# Altium schematic sheet Micro.SchDoc
size A
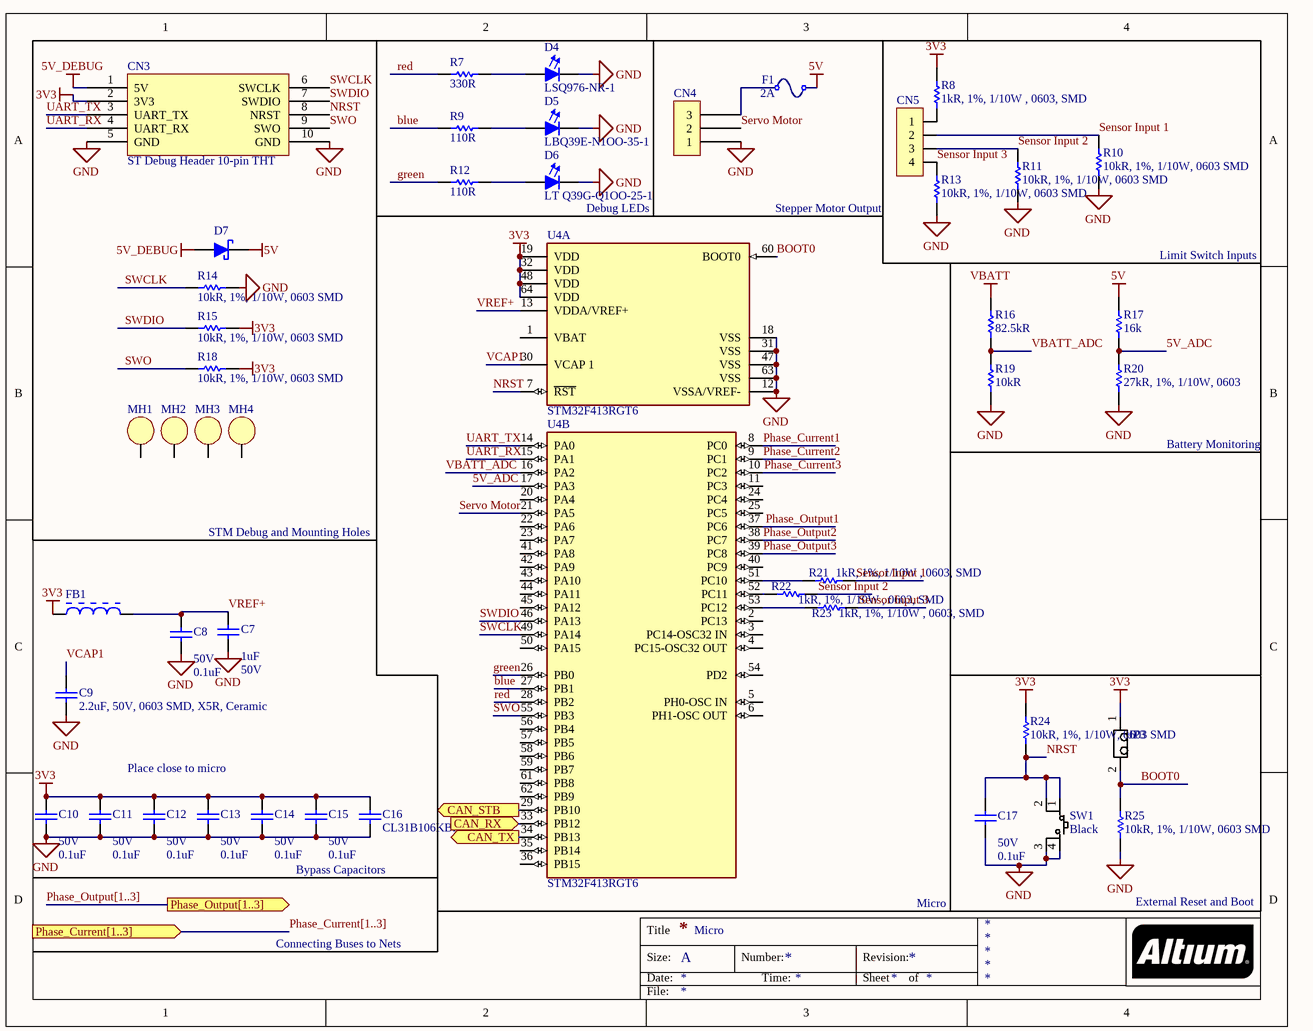
[diagram p0: Micro.SchDoc]

## Parts
C7  Capacitance: 1uF  Voltage: 50V  [0803 CAP]  (hidden comment: CL21B105KBFNNNG)
C8  Voltage: 50V  Capacitance: 0.1uF  [FP-CL10-0_1-IPC_A]  (hidden comment: CL10B104JB8NNNC)
C9  2.2uF, 50V, 0603 SMD, X5R, Ceramic  [CAPC1608N(0603")]
C10  Voltage: 50V  Capacitance: 0.1uF  [FP-CL10-0_1-IPC_A]  (hidden comment: CL10B104JB8NNNC)
C11  Voltage: 50V  Capacitance: 0.1uF  [FP-CL10-0_1-IPC_A]  (hidden comment: CL10B104JB8NNNC)
C12  Voltage: 50V  Capacitance: 0.1uF  [FP-CL10-0_1-IPC_A]  (hidden comment: CL10B104JB8NNNC)
C13  Voltage: 50V  Capacitance: 0.1uF  [FP-CL10-0_1-IPC_A]  (hidden comment: CL10B104JB8NNNC)
C14  Voltage: 50V  Capacitance: 0.1uF  [FP-CL10-0_1-IPC_A]  (hidden comment: CL10B104JB8NNNC)
C15  Voltage: 50V  Capacitance: 0.1uF  [FP-CL10-0_1-IPC_A]  (hidden comment: CL10B104JB8NNNC)
C16  CL31B106KBHNNNE  [CAPC3216X180X50ML20T30]
C17  Voltage: 50V  Capacitance: 0.1uF  [FP-CL10-0_1-IPC_A]  (hidden comment: CL10B104JB8NNNC)
CN3  ST Debug Header 10-pin THT  [10-pin shrouded header THT]
CN4  Header, Male, 1x3, RA, Pitch (2.54mm) 0.1"  [5-103635-2-Footprint-1]  (value not drawn)
CN5  Header, Male, 1x4, RA, Pitch 0.1" (2.54mm)  [HEADER, MALE, SHROUDED, 4x1, PITCH 0.1" (2.54mm), RA]  (value not drawn)
D4  LSQ976-NR-1  [FP-LB_Q39E-MFG]
D5  LBQ39E-N1OO-35-1  [FP-LB_Q39E-MFG]
D6  LT Q39G-Q1OO-25-1  [FP-LB_Q39E-MFG]
D7  CUS08F30,H3F  [SC-76]  (value not drawn)
F1  Current: 2A  [1206 SMD]  (hidden comment: SMD Fuse, 2A, 63V,)
FB1  BLM18AG601SN1D  [MURA-BLM18-F-H1-CHIP-2_V]  (value not drawn)
JP3  1x2 Male Header  [2X1 Males Header]  (value not drawn)
MH1  Mount_Hole_3mm  [Mount-Hole_3mm]  (value not drawn)
MH2  Mount_Hole_3mm  [Mount-Hole_3mm]  (value not drawn)
MH3  Mount_Hole_3mm  [Mount-Hole_3mm]  (value not drawn)
MH4  Mount_Hole_3mm  [Mount-Hole_3mm]  (value not drawn)
R7  Resistance: 330R  [FP-CRCW0603-e3-IPC_A]  (hidden comment: CRCW0603330RFKEA)
R8  1kR, 1%, 1/10W , 0603, SMD  [RESC1608N(0603")]
R9  Resistance: 110R  [RESC1608X55X25ML10T15]  (hidden comment: RC0603FR-07110RL)
R10  10kR, 1%, 1/10W, 0603 SMD  [RESC1608N(0603")]
R11  10kR, 1%, 1/10W, 0603 SMD  [RESC1608N(0603")]
R12  Resistance: 110R  [RESC1608X55X25ML10T15]  (hidden comment: RC0603FR-07110RL)
R13  10kR, 1%, 1/10W, 0603 SMD  [RESC1608N(0603")]
R14  10kR, 1%, 1/10W, 0603 SMD  [RESC1608N(0603")]
R15  10kR, 1%, 1/10W, 0603 SMD  [RESC1608N(0603")]
R16  Resistance: 82.5kR  [RESC1608X55X30ML15T15]  (hidden comment: ERJ-3EKF8252V)
R17  value 16k  [RESC1608N(0603")]  (hidden comment: 16kR, 1%, 1/10W, 0603 SMD)
R18  10kR, 1%, 1/10W, 0603 SMD  [RESC1608N(0603")]
R19  Resistance: 10kR  [RESC1608X55X25ML10T15]  (hidden comment: RC0603FR-0710KL)
R20  27kR, 1%, 1/10W, 0603  [FP-CRGCQ0603-IPC_B]
R21  1kR, 1%, 1/10W , 0603, SMD  [RESC1608N(0603")]
R22  1kR, 1%, 1/10W , 0603, SMD  [RESC1608N(0603")]
R23  1kR, 1%, 1/10W , 0603, SMD  [RESC1608N(0603")]
R24  10kR, 1%, 1/10W, 0603 SMD  [RESC1608N(0603")]
R25  10kR, 1%, 1/10W, 0603 SMD  [RESC1608N(0603")]
SW1  Button Colour: Black  [4-SPST-NO]  (hidden comment: PTS645SL43SMTR92LFS)
U4  STM32F413RGT6  [FP-LQFP64-5W-IPC_A]  (parts A,B of 2)

## Blocks framed on the sheet
STM Debug and Mounting Holes: CN3 D7 MH1-MH4 R14 R15 R18
Debug LEDs: D4-D6 R7 R9 R12
Stepper Motor Output: CN4 F1
Limit Switch Inputs: CN5 R8 R10 R11 R13

## Ports
CAN_RX (in), CAN_STB (out), CAN_TX (out), Phase_Current[1..3] (in), Phase_Output[1..3] (out)

## Nets
3V3: C10.1 C11.1 C12.1 C13.1 C14.1 C15.1 C16.1 CN3.2(3V3) FB1.1 JP3.1 R8.1 R15.1 R18.1 R24.1 U4.19(VDD) U4.32(VDD) U4.48(VDD) U4.64(VDD)
5V: D7.K(Cathode) F1.2 R17.2
5V_DEBUG: CN3.1(5V) D7.A(Anode)
GND: C7.2 C8.2 C9.2(Cathode) C10.2 C11.2 C12.2 C13.2 C14.2 C15.2 C16.2 C17.2 CN3.5(GND) CN3.10(GND) CN4.1 D4.1(Cathode) D5.1(Cathode) D6.1(Cathode) R10.2 R11.2 R13.2 R14.1 R19.2 R20.1 R25.2 SW1.3 SW1.4 U4.12(VSSA/VREF-) U4.18(VSS) U4.31(VSS) U4.47(VSS) U4.63(VSS)
VBATT: R16.1
5V_ADC: R17.1 R20.2 U4.17(PA3)
blue: R9.1 U4.27(PB1)
BOOT0: JP3.2 R25.1 U4.60(BOOT0)
CAN_RX: U4.33(PB12) ; port CAN_RX
CAN_STB: U4.29(PB10) ; port CAN_STB
CAN_TX: U4.34(PB13) ; port CAN_TX
green: R12.1 U4.26(PB0)
NRST: C17.1 CN3.8(NRST) R24.2 SW1.1 SW1.2 U4.7(~{RST})
Phase_Current1: U4.8(PC0)
Phase_Current2: U4.9(PC1)
Phase_Current3: U4.10(PC2)
Phase_Output1: U4.37(PC6)
Phase_Output2: U4.38(PC7)
Phase_Output3: U4.39(PC8)
red: R7.1 U4.28(PB2)
Sensor Input 1: CN5.2 R10.1 R21.2
Sensor Input 2: CN5.3 R11.1 R22.2
Sensor Input 3: CN5.4 R13.1 R23.2
Servo Motor: CN4.2 U4.21(PA5)
SWCLK: CN3.6(SWCLK) R14.2 U4.49(PA14)
SWDIO: CN3.7(SWDIO) R15.2 U4.46(PA13)
SWO: CN3.9(SWO) R18.2 U4.55(PB3)
UART_RX: CN3.4(UART_RX) U4.15(PA1)
UART_TX: CN3.3(UART_TX) U4.14(PA0)
VBATT_ADC: R16.2 R19.1 U4.16(PA2)
VCAP1: C9.1(Anode) U4.30(VCAP_1)
VREF+: C7.1 C8.1 FB1.2 U4.13(VDDA/VREF+)
NetCN4_3: CN4.3 F1.1
NetCN5_1: CN5.1 R8.2
NetD4_2: D4.2(Anode) R7.2
NetD5_2: D5.2(Anode) R9.2
NetD6_2: D6.2(Anode) R12.2
NetR21_1: R21.1 U4.51(PC10)
NetR22_1: R22.1 U4.52(PC11)
NetR23_1: R23.1 U4.53(PC12)

Not connected (* = marked no-connect by the designer): MH1 1; MH2 1; MH3 1; MH4 1; U4 1(VBAT) 2(PC13) 3(PC14-OSC32_IN) 4(PC15-OSC32_OUT) 5(PH0-OSC_IN) 6(PH1-OSC_OUT) 11(PC3) 20(PA4) 22(PA6) 23(PA7) 24(PC4) 25(PC5) 35(PB14) 36(PB15) 40(PC9) 41(PA8) 42(PA9) 43(PA10) 44(PA11) 45(PA12) 50(PA15) 54(PD2) 56(PB4) 57(PB5) 58(PB6) 59(PB7) 61(PB8) 62(PB9)

## Buses and harness runs
bus Phase_Current[1..3] = port Phase_Current[1..3]
bus Phase_Output[1..3] = port Phase_Output[1..3]

## Notes on the sheet
- Battery Monitoring
- Place close to micro
- Bypass Capacitors
- Micro
- External Reset and Boot
- Connecting Buses to Nets
- Title
- Size:
- Date:
- A
- Number:
- Time:
- Revision:
- Sheet
- of
- File:

## Library data of the parts
C7 = CMP-00005-3: SAMSUNG ELECTRO-MECHANICS - CL21B105KBFNNNG - MLCC CAPACITORS; Tolerance: 10%; Material: Ceramic; Dielectric: X7R; Case/Package: 0805; Voltage Rating: 50V; Contact Plating: Tin; Max Operating Temperature: 125°C; Termination: Wraparound; Package Quantity: 3000; Depth: 1.25mm; Mount: Surface Mount; Min Operating Temperature: -55°C; Thickness: 0.053inch; Packaging: Tape and Reel; Case Code (Metric): 2012; Length: 2mm; Case Code (Imperial): 0805; Width: 0.049inch
C8 C10-C15 C17 = CMP-00000-4: CAP CER 0.1UF 50V X7R 0603; Tolerance: 5%; Material: Ceramic; Case Code (Imperial): 0603; Mount: Surface Mount; Thickness: 0.035inch; Depth: 0.8mm; Packaging: Tape and Reel; Package Quantity: 1; Dielectric: X7R; Height: 0.8mm; Radiation Hardening: No; Max Operating Temperature: 125°C; Voltage Rating: 50V; Case/Package: 0603; Min Operating Temperature: -55°C; Case Code (Metric): 1608; Length: 1.6mm; Contact Plating: Tin; Width: 0.031inch
C9 = CMP-006-0030-1: Capacitor, Ceramic, 50V, 10%, 0603 SMD, X5R; Value: 2.2µF; Date Created: *; Design Item ID: 2.2uF, 50V, 0603 SMD, X5R, Ceramic; Made By: *; Publisher: AUVic; Source: AUVic_Schematic_Library_Capacitors.SchLib; Pin Count: 2; PackageDescription: Chip Capacitor; Component Type: Standard
C16 = CMP-00004-1: Cap Ceramic 10uF 50V X7R 10% Pad SMD 1206 125°C T/R; Thickness: 0.071inch; Case/Package: 1206; Case Code (Metric): 3216; Case Code (Imperial): 1206; Voltage Rating: 50V; Length: 0.126inch; Max Operating Temperature: 125°C; Voltage Rating (DC): 50V; Capacitance: 10uF; Dielectric: X7R; Lead Free: Lead Free; Min Operating Temperature: -55°C; Tolerance: 10%; Mount: Surface Mount; Packaging: Tape and Reel; Width: 0.063inch
CN3 = CMP-00011-6: CONN HEADER VERT 10POS 2.54MM; Row Spacing: 0.1inch; Connector Type: Male Pin; Number of Positions: 10; Packaging: Tray; Package Quantity: 1; Color: Black; Number of Rows: 2; Termination: Solder; Contact Plating: Gold; Lead Free: Lead Free; Pitch: 0.1inch; Mount: Through Hole
CN4 = CMP-00099-4: CONN HEADER RT/A .100 3POS 15AU; Mating Alignment: Yes (With); Number of Positions: 3; Approvals: CSA; Connector Type: Plug,Header,Pin; Insulation Resistance: 5GR; Row Spacing: 0.1inch; PCB Mount Retention: Without; Plating Thickness: 2.54um; Strain Relief: No (Without); PCB Mounting Orientation: Right Angle; Tail Length: 3.3mm; Contact Current Rating: 3A; Contact Resistance: 15mR; Mount: Through Hole; Number of Rows: 1; Contact Plating: Gold,Tin,Matte; Contact Shape: Square; Pitch: 2.54mm; Contact Retention: Yes (With); Length: 0.4inch; Height: 13.59mm; Packaging: Rail/Tube; Contact Material: Brass; Width: 0.4inch; Housing Color: Black; Housing Material: Thermoplastic; Depth: 13.59mm; Color: Black; Termination: Crimp; Max Operating Temperature: 105°C; Lead Pitch: 2.54mm; Current Rating: 3A; Package Quantity: 52; Number of Contacts: 3; REACH SVHC: No SVHC; Contact Mating Length: 0.23inch; Orientation: Right Angle; Backwall/Post Interruptions: No (Without); Mating Retention: Yes (With); Min Operating Temperature: -65°C; Contact Gender: Male; PCB Mount Alignment: No (Without); Flammability Rating: UL94 V-0
CN5 = CMP-005-0029-3: Connector Header Through Hole, Right Angle 4 position 0.100" (2.54mm); Source: AUVic_Schematic_Library_Connectors.SchLib; Created On: 2020-05-20; Pin Count: 4; Component Type: Standard; Design Item ID: Header, Male, 1x4, RA, Pitch 0.1" (2.54mm); Created By: Miguel Manguerra
D4 = CMP-00066-2: LED Red 645nm 2-Pin Chip 0603(1608Metric) T/R; Lens Transparency: Diffused; Power Dissipation: 65mW; Forward Voltage: 2.5V; Dominant Wavelength: 633nm; Number of Elements: 1; Lens Style: Diffused,Flat,Colorless,Rectangular; Lens Color: White; Viewing Angle: 160°; Luminous Flux: 0.33lm; Test Current: 20mA; Forward Current: 25mA; Luminous Intensity: 180mcd; Reverse Voltage: 12V; Lens Size: 0.8mm; Max Operating Temperature: 85°C; Depth: 0.9mm; Illumination Color: Red; Color: Red; Packaging: Tape and Reel; Min Operating Temperature: -30°C; Case Code (Imperial): 0603; Case Code (Metric): 1608; Number of Pins: 2; Mount: Surface Mount; Height: 0.8mm; Package Quantity: 1; Length: 1.7mm; Width: 0.8mm; Number of LEDs: 1; Case/Package: 0603; Radiation Hardening: No
D5 = CMP-00063-3: LED BLUE DIFFUSED 0603 SMD; Luminous Flux: 0.13lm; Lens Size: 0.8mm; Lens Color: White; Viewing Angle: 130°; Luminous Intensity: 42mcd; Number of LEDs: 1; Dominant Wavelength: 470nm; Lens Style: Flat,Diffused,Colorless,Rectangular; Test Current: 5mA; Forward Voltage: 2.85V; Packaging: Tape and Reel; Case/Package: 0603; Height: 0.4mm; Number of Pins: 2; Mount: Surface Mount; Case Code (Metric): 1608; Case Code (Imperial): 0603; Lens Transparency: Diffused; Width: 0.8mm; Length: 1.6mm; Color: Blue; Radiation Hardening: No
D6 = CMP-00064-3: LED GREEN DIFFUSED 0603 SMD; Dominant Wavelength: 530nm; Luminous Intensity: 280mcd; Lens Style: Diffused,Colorless,Rectangular; Number of LEDs: 1; Forward Voltage: 2.85V; Test Current: 5mA; Reverse Voltage: 5V; Forward Current: 15mA; Luminous Flux: 0.55lm; Radiation Hardening: No; Packaging: Tape and Reel; Mount: Surface Mount; Color: Green; Max Operating Temperature: 85°C; Number of Elements: 1; Number of Pins: 2; Min Operating Temperature: -40°C; Depth: 0.9mm; Case/Package: SMD/SMT; Length: 1.7mm
D7 = CMP-057-0000-2: Diode Schottky 30V 800mA Surface Mount USC; Peak Non-Repetitive Surge Current: 5A; Element Configuration: Single; Peak Reverse Current: 50uA; Packaging: Tape and Reel; Mount: Surface Mount; Average Rectified Current: 800mA; Case/Package: SOD; Max Reverse Voltage (DC): 30V; Min Operating Temperature: -55°C; Contact Plating: Tin,Silver; Max Repetitive Reverse Voltage (Vrrm): 30V; Number of Pins: 2; Max Operating Temperature: 125°C
F1 = CMP-027-0004-1: Design Item ID: SMD Fuse, 2A, 63V,; Component Type: Standard; Source: AUVic_Integrated_Library_Fuses.SchLib; ComponentLink1Description: Digi-Key; Date Created: 2018-06-07; ComponentLink1URL: https://www.digikey.ca/product-detail/en/bel-fuse-inc/C1F-2/507-1881-1-ND/4968159; Type: SMD; Created By: Poorna Chander Kalidas; Pin Count: 2
FB1 = CMP-00016-1: MURATA - BLM18AG601SN1D - Feritový Korálek, 0603 / 1608, 600 ohm, 500 mA, Série BLM18A, 0.38 ohm, ± 25%; DC Current: 500mA; Impedance: 600R; DC Resistance (DCR): 380mR; Core Material: Ferrite; Shielding: Unshielded; Number of Lines: 1; Test Frequency: 100MHz; Material: Steel,Ferrite; Height: 0.8mm; Depth: 0.8mm; Min Operating Temperature: -55°C; Packaging: Tape and Reel; Weight: 7.1E-05oz; Width: 0.8mm; Military Standard: Not; Max Operating Temperature: 125°C; Max Current Rating: 500mA; Case Code (Metric): 1608; Length: 1.6mm; Case Code (Imperial): 0603; Package Quantity: 1; Max DC Current: 500mA; REACH SVHC: No SVHC; Termination: SMD/SMT; Current Rating: 500mA; Lead Free: Lead Free; Tolerance: 25%; Case/Package: 0603; Number of Pins: 2; Radiation Hardening: No; Frequency: 100MHz; Number of Circuits: 1
JP3 = CMP-004-0001-1: Made By: Andy Bates; Source: AUVic_Schematic_Library_Connectors.SchLib; Pin Count: 2; Design Item ID: 1x2 Male Header; Component Type: Standard
MH1-MH4 = CMP-004-0010-4: Mounting hold for M3 hex standoff; Source: AUVic_Schematic_Library_Connectors.SchLib; Design Item ID: Mount_Hole_3mm; Component Type: Standard; Pin Count: 1
R7 = CMP-00067-2: Res Thick Film 0603 330 Ohm 1% 0.1W(1/10W) +/-100ppm/ßC Pad SMD Automotive T/R; Voltage Rating (DC): 75V; Power Rating: 100mW; Temperature Coefficient: 100ppm/°C; Contact Plating: Tin; Package Quantity: 10; Tolerance: 1%; Packaging: Tape and Reel; Case/Package: 0603; Max Operating Temperature: 155°C; Case Code (Metric): 1608; Case Code (Imperial): 0603; Min Operating Temperature: -55°C; Length: 1.55mm; Height: 0.45mm; Lead Free: Lead Free; Termination: SMD/SMT; Voltage Rating: 75V; Composition: Thick Film; Weight: 7.1E-05oz; Military Standard: Not; Max Power Dissipation: 100mW; REACH SVHC: Unknown; Mount: Surface Mount; Depth: 0.85mm; Features: Automotive AEC-Q200; Number of Terminations: 2; Radiation Hardening: No; Width: 0.033inch
R8 R21-R23 = CMP-047-0024-1: Value: 1k; Component Type: Standard; Publisher: AUVic; Source: AUVic_Schematic_Library_Resistors.SchLib; Date Created: 2017-05-10; Pin Count: 2; Created By: Andy Bates; Design Item ID: 1kR, 1%, 1/10W , 0603, SMD
R9 R12 = CMP-00069-1: RES SMD 110 OHM 1% 1/10W 0603; Max Power Dissipation: 100mW; Voltage Rating (DC): 50V; Temperature Coefficient: 100ppm/°C; Working Voltage: 75V; Military Standard: Not; Termination: SMD/SMT; Number of Terminations: 2; Features: Moisture Resistant; Min Operating Temperature: -55°C; Power Rating: 100mW; Height: 0.022inch; Package Quantity: 1; Lead Free: Lead Free; Tolerance: 1%; Voltage Rating: 50V; Composition: Thick Film; Case Code (Imperial): 0603; Length: 1.6mm; Packaging: Tape and Reel; Case Code (Metric): 1608; Max Operating Temperature: 155°C; Depth: 0.8mm; Case/Package: 0603; Width: 0.031inch
R10 R11 R13-R15 R18 R24 R25 = CMP-047-0013-1: Owned By: AUVic; Made By: Ashwin Sira; Value: 10k; Design Item ID: 10kR, 1%, 1/10W, 0603 SMD; Pin Count: 2; Component Type: Standard; Created On: 14-05-31; Last Edited: 14-05-31; Source: AUVic_Schematic_Library_Resistors.SchLib
R16 = CMP-00085-1: RES SMD 82.5K OHM 1% 1/10W 0603; Power Rating: 100mW; Temperature Coefficient: 100ppm/°C; Voltage Rating (DC): 50V; Voltage Rating: 75V; Case/Package: 0603; Case Code (Imperial): 0603; Composition: Thick Film; Depth: 0.8mm; Min Operating Temperature: -55°C; Width: 0.031inch; Height: 0.022inch; Military Standard: Not; Packaging: Tape and Reel; Termination: SMD/SMT; Lead Free: Lead Free; Max Operating Temperature: 155°C; REACH SVHC: No SVHC; Case Code (Metric): 1608; Tolerance: 1%; Length: 1.6mm; Features: Automotive AEC-Q200; Package Quantity: 1; Max Power Dissipation: 100mW; Radiation Hardening: No; Contact Plating: Tin; Number of Terminations: 2; Mount: Surface Mount
R17 = CMP-047-0021-1: Owned By: AUVic; Made By: Ashwin Sira; Last Edited: 14-05-31; Source: AUVic_Schematic_Library_Resistors.SchLib; Created On: 14-05-31; Component Type: Standard; Design Item ID: 16kR, 1%, 1/10W, 0603 SMD; Pin Count: 2
R19 = CMP-00037-1: Res General Purpose Thick Film 0603 10K Ohm 1% 1/10W ±100ppm/°C Molded SMD Paper T/R; Power Rating: 100mW; Voltage Rating (DC): 50V; Voltage Rating: 75V; Case/Package: 0603; Weight: 7.1E-05oz; Case Code (Imperial): 0603; Composition: Thick Film; Depth: 0.8mm; Min Operating Temperature: -55°C; Width: 0.8mm; Height: 0.45mm; Military Standard: Not; Packaging: Tape and Reel; Termination: SMD/SMT; Lead Free: Lead Free; Temperature Coefficient: 100ppm/°C; Number of Pins: 2; Max Operating Temperature: 155°C; Lead Pitch: 0.3mm; REACH SVHC: No SVHC; Case Code (Metric): 1608; Tolerance: 1%; Length: 1.6mm
R20 = CMP-00090-2: Res Thick Film 0603 27K Ohm 1% 0.1W(1/10W) ±100ppm/C Pad SMD Automotive T/R
SW1 = CMP-00077-1: Black Switch Tactile N.O. SPST Round Button Gull Wing 0.05A 12VDC 100000Cycles 1.27N SMD T/R; Actuator Material: Nylon,Polyamide; Switch Function: Off-Mom; Actuator Type: Standard; Illumination Type: Non-Illuminated; Max Voltage Rating (DC): 12V; Current Rating: 50mA; Actuator Length: 0.85mm; Contact Resistance: 100mR; Depth: 9mm; Length: 6mm; Termination: Gull Wing; Max Operating Temperature: 60°C; Mechanical Life: 100000Cycles; Packaging: Tape and Reel; Color: Black; Throw Configuration: SPST; Min Operating Temperature: -20°C; Mount: Surface Mount; Lead Free: Lead Free; Operating Force: 1.27N; Contact Material: Bronze,Brass,Silver; Max Current Rating: 50mA; Package Quantity: 1000; Voltage Rating (DC): 12V; Contact Plating: Silver; Orientation: Straight
U4 = CMP-00006-2: STMICROELECTRONICS - STM32F413RGT6 - MCU, ARM CORTEX-M4, 100MHZ, LQFP-64; Number of I/Os: 50; Oscillator Type: Internal; Peripherals: Brown-out Detect/Reset,POR,PWM,WDT,DMA,LCD; Interface: I2C,SPI,USB,IrDA,MMC,SDIO,UART,USART; Memory Type: FLASH; Memory Size: 1MB; Case/Package: LQFP; Packaging: Tray; Core Architecture: ARM; Min Operating Temperature: -40°C; Max Operating Temperature: 85°C; Frequency: 100MHz